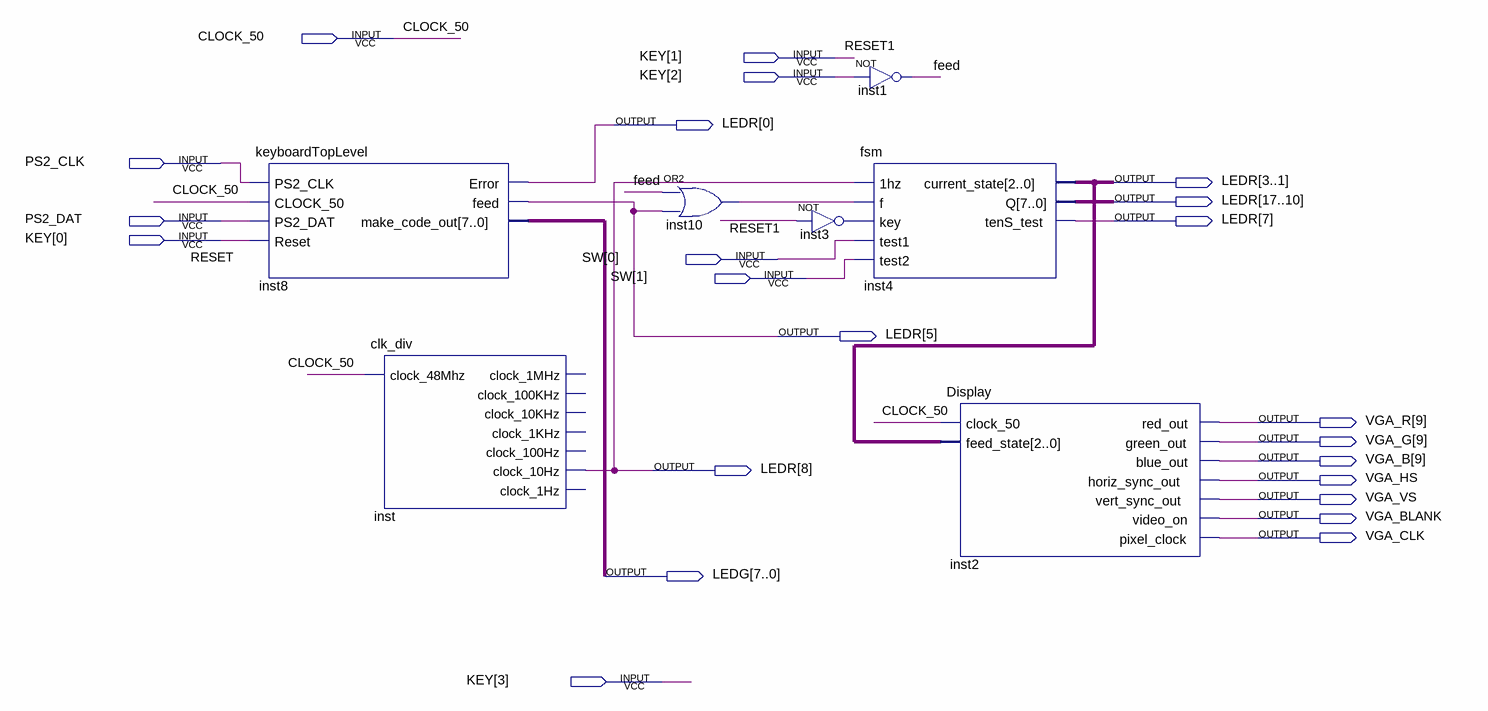
[diagram p0: schematic sheet]
// Quartus schematic tamagotchi.bdf as structural Verilog: 7 symbols, 23 pins
module tamagotchi (
  input  CLOCK_50,
  input  [3:0] KEY,
  input  PS2_CLK,
  input  PS2_DAT,
  input  [1:0] SW,
  output [17:0] LEDR,
  output [9:9] VGA_R,
  output [9:9] VGA_G,
  output [9:9] VGA_B,
  output VGA_HS,
  output VGA_VS,
  output VGA_BLANK,
  output VGA_CLK,
  output [7:0] LEDG
);

  wire feed, inst3_out, inst10_out;

  keyboardTopLevel inst8 (
    .PS2_CLK(PS2_CLK), .CLOCK_50(CLOCK_50), .PS2_DAT(PS2_DAT), .Reset(KEY[0]), .Error(LEDR[0]),
    .feed(LEDR[5]), .make_code_out(LEDG));
  clk_div inst (
    .clock_48Mhz(CLOCK_50), .clock_10Hz(LEDR[8]));  // open: clock_1MHz, clock_100KHz, clock_10KHz, clock_1KHz, clock_100Hz, clock_1Hz
  or inst10 (inst10_out, feed, LEDR[5]);
  not inst1 (feed, KEY[2]);
  fsm inst4 (
    .\1hz (LEDR[8]), .f(inst10_out), .key(inst3_out), .test1(SW[0]), .test2(SW[1]),
    .current_state(LEDR[3:1]), .Q(LEDR[17:10]), .tenS_test(LEDR[7]));
  not inst3 (inst3_out, KEY[1]);
  Display inst2 (
    .clock_50(CLOCK_50), .feed_state(LEDR[3:1]), .red_out(VGA_R[9]), .green_out(VGA_G[9]),
    .blue_out(VGA_B[9]), .horiz_sync_out(VGA_HS), .vert_sync_out(VGA_VS), .video_on(VGA_BLANK),
    .pixel_clock(VGA_CLK));

  // Other names for the same wires on the sheet: RESET = KEY[0]; RESET1 = KEY[1]
endmodule
